# EAGLE schematic eccosorb_filter_v1-xld250 (EAGLE 9.3.0)
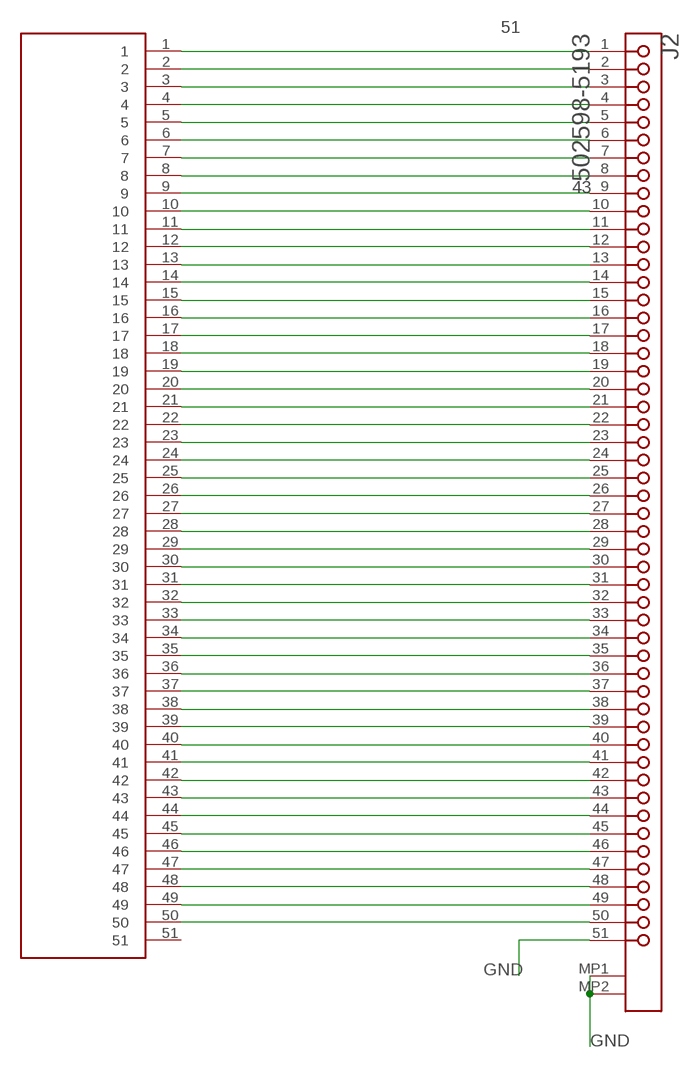
[diagram p0: schematic, sheet 1]

## Parts
J2  MOLEX_502598-5193MOLEX_502598-5193_0_0  [MOLEX_502598-5193_0]
U$1  502598-5193_JUMPER  [MOLEX_502598-5193-JUMPER]

## Nets
2: J2.50 U$1.50
3: J2.49 U$1.49
4: J2.48 U$1.48
5: J2.47 U$1.47
6: J2.46 U$1.46
7: J2.45 U$1.45
8: J2.44 U$1.44
9: J2.43 U$1.43
10: J2.42 U$1.42
11: J2.41 U$1.41
12: J2.40 U$1.40
13: J2.39 U$1.39
14: J2.38 U$1.38
15: J2.37 U$1.37
16: J2.36 U$1.36
17: J2.35 U$1.35
18: J2.34 U$1.34
19: J2.33 U$1.33
20: J2.32 U$1.32
21: J2.31 U$1.31
22: J2.30 U$1.30
23: J2.29 U$1.29
24: J2.28 U$1.28
25: J2.27 U$1.27
26: J2.26 U$1.26
27: J2.25 U$1.25
28: J2.24 U$1.24
29: J2.23 U$1.23
30: J2.22 U$1.22
31: J2.21 U$1.21
32: J2.20 U$1.20
33: J2.19 U$1.19
34: J2.18 U$1.18
35: J2.17 U$1.17
36: J2.16 U$1.16
37: J2.15 U$1.15
38: J2.14 U$1.14
39: J2.13 U$1.13
40: J2.12 U$1.12
41: J2.11 U$1.11
42: J2.10 U$1.10
43: J2.9 U$1.9
44: J2.8 U$1.8
45: J2.7 U$1.7
46: J2.6 U$1.6
47: J2.5 U$1.5
48: J2.4 U$1.4
49: J2.3 U$1.3
50: J2.2 U$1.2
51: J2.1 U$1.1
GND: J2.51 J2.MP1 J2.MP2
Unconnected: U$1.51

## Library data of the parts
J2 = Molex - 502598-5193:MOLEX_502598-5193: MOLX-502598-5193; CIIVA_IDS: 8412513; CIRCUITS_LOADED: 51; COMPONENT_LINK_1_DESCRIPTION: Manufacturer URL; COMPONENT_LINK_1_URL: http://www.molex.com/molex/index.jsp; COMPONENT_LINK_3_DESCRIPTION: Package Specification; COMPONENT_LINK_3_URL: http://www.molex.com/pdm_docs/sd/5025985193_sd.pdf; CONTACT_POSITION: Dual; CURRENT_MAX_PER_CONTACT: 0.2A; DATASHEET: http://www.molex.com/webdocs/datasheets/pdf/en-us/5025985193_FFC_FPC_CONNECTORS.pdf; DURABILITY_MATING_CYCLES_MAX: 10; ENTRY_ANGLE: 90degrees Angle; FOOTPRINT_VARIANT_NAME_0: Manufacturer Recommended; IMPORTED: yes; IMPORTED_FROM: vault; IMPORT_TS: 1521860080; MATED_HEIGHT: 1.15mm; MATERIAL___METAL: Copper Alloy, Phosphor Bronze; MATERIAL___PLATING_MATING: Gold; MATERIAL___PLATING_TERMINATION: Gold, Tin; MF: Molex; MOUNTING_TECHNOLOGY: Surface Mount; MPN: 502598-5193; NUMBER_OF_ROWS: 1; ORIENTATION: Right Angle; PACKAGE: 502598-5193; PACKAGE_DESCRIPTION: 51-Lead FPC Connector, Pitch 0.3 mm; PACKAGE_VERSION: Rev. B, 08/2013; PACKING: Tape and Reel; PCB_LOCATOR: No; PCB_RETENTION: Yes; PITCH___MATING_INTERFACE: 0.30mm; POLARIZED_TO_PCB: Yes; PREFIX: J; RELEASE_DATE: 1411372322; ROHS: Yes; STACKABLE: No; VAULT_GUID: 79943B7E-3FDB-4B6C-B1B1-74E826A886CC; VAULT_REVISION: 2B392736-9C86-4257-9195-559BF0CEA94B; VOLTAGE_MAX: 50V AC (RMS)/DC
U$1 = molex_502598-5193-card:502598-5193_JUMPER: card edge to match Molex 502598-5193

## Net classes
0 default: width 0.1 mm, drill 0.2 mm, clearance 0.1 mm